# EAGLE design aasaver_v11 (EAGLE 5.11)
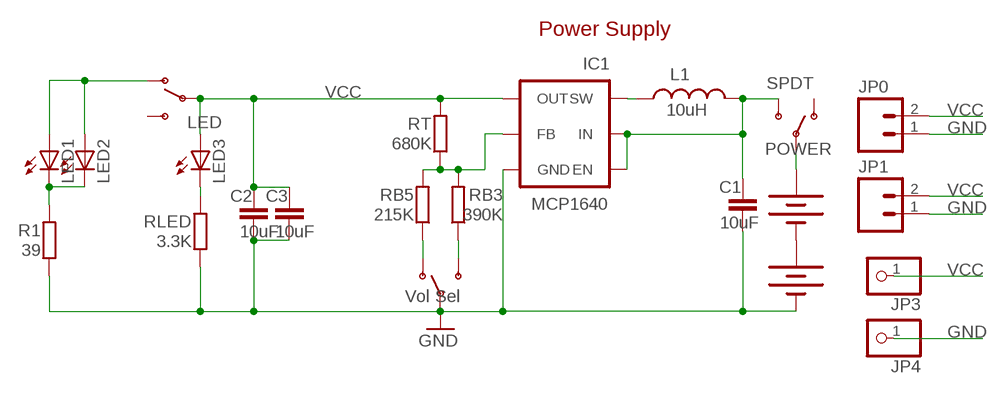
[diagram p0: schematic, sheet 1]

## Parts
AA1  BATTERYAA  [BATTERY-AA]
AA2  BATTERYAA  [BATTERY-AA]
C1  10uF  C-EUC0805  [C0805]
C2  10uF  C-EUC0805  [C0805]
C3  10uF  C-EUC0805  [C0805]
IC1  MCP1640  [TSOT23-6]
JP0  M021X02_NO_SILK  [1X02_NO_SILK]
JP1  M021X02_NO_SILK  [1X02_NO_SILK]
JP3  PINHD-1X1CB  [1X01-CLEANBIG]
JP4  PINHD-1X1CB  [1X01-CLEANBIG]
L1  10uH  INDUCTOR_SMDD30  [INDUCTOR_D30]
LED  SWITCH-SPSTSMD2  [SWITCH-SPDT-SMD]
LED1  LED3MM  [LED3MM]
LED2  LED3MM  [LED3MM]
LED3  0805  LEDCHIPLED_0805  [CHIPLED_0805]
POWER  SPDT  SWITCH-SPSTSMD2  [SWITCH-SPDT-SMD]
R1  39  R-EU_R0805  [R0805]
RB3  390K  R-EU_R0805  [R0805]
RB5  215K  R-EU_R0805  [R0805]
RLED  3.3K  R-EU_R0805  [R0805]
RT  680K  R-EU_R0805  [R0805]
VOL1  Vol Sel  SWITCH-SPSTSMD2  [SWITCH-SPDT-SMD]

## Nets
GND: AA2.GND@1(-) C1.2 C2.2 C3.2 IC1.2(GND) JP0.1 JP1.1 JP4.1 R1.1 RLED.1 VOL1.2(P)
N$1: IC1.4(FB) RB3.2 RB5.2 RT.1
N$2: RB5.1 VOL1.1(O)
N$3: RB3.1 VOL1.3(S)
N$4: LED1.K(C) LED2.K(C) R1.2
N$6: AA1.PWR@1(+) POWER.2(P)
N$7: LED1.A LED2.A LED.1(O)
N$8: LED3.C RLED.2
N$16: AA1.GND@1(-) AA2.PWR@1(+)
N$26 [power]: IC1.1(SW) L1.P$2
PWR [power]: C1.1 IC1.3(EN) IC1.6(IN) L1.P$1 POWER.3(S)
VCC: C2.1 C3.1 IC1.5(OUT) JP0.2 JP1.2 JP3.1 LED3.A LED.2(P) RT.2
Unconnected: LED.3(S) POWER.1(O)

## Notes on the sheet
- Power Supply

## Library data of the parts
AA1 AA2 = SparkFun:BATTERY: Battery Holders Various common sizes : AA, AAA, 20mm coin cell and 12mm coin cell.
C1-C3 = resistor:C-EU: CAPACITOR, European symbol
IC1 = linear-technology:MCP1640
JP0 JP1 = SparkFun:M02: Header 2 Standard 2-pin 0.1" header. Use with straight break away headers (SKU : PRT-00116), right angle break away headers (PRT-00553), swiss pins (PRT-00743), machine pins (PRT-00117), and female headers (PRT-00115). Molex polarized connector foot print use with SKU : PRT-08233 with associated crimp pins and housings.
JP3 JP4 = adafruit:PINHD-1X1: Pin header 1x1 for 0.1" spacing With round pins
L1 = linear-technology:INDUCTOR_SMD
LED POWER VOL1 = SparkFun:SWITCH-SPST: SPST Switch Simple slide switch. Spark Fun Electronics SKU : COM-00102
LED1 LED2 = adafruit:LED: LED
LED3 = led:LED: LED
R1 RB3 RB5 RLED RT = rcl:R-EU_: RESISTOR, European symbol

## Net classes
0 default: width 0.406 mm, clearance 0.203 mm
1 power: width 0.406 mm, clearance 0.203 mm

## Board
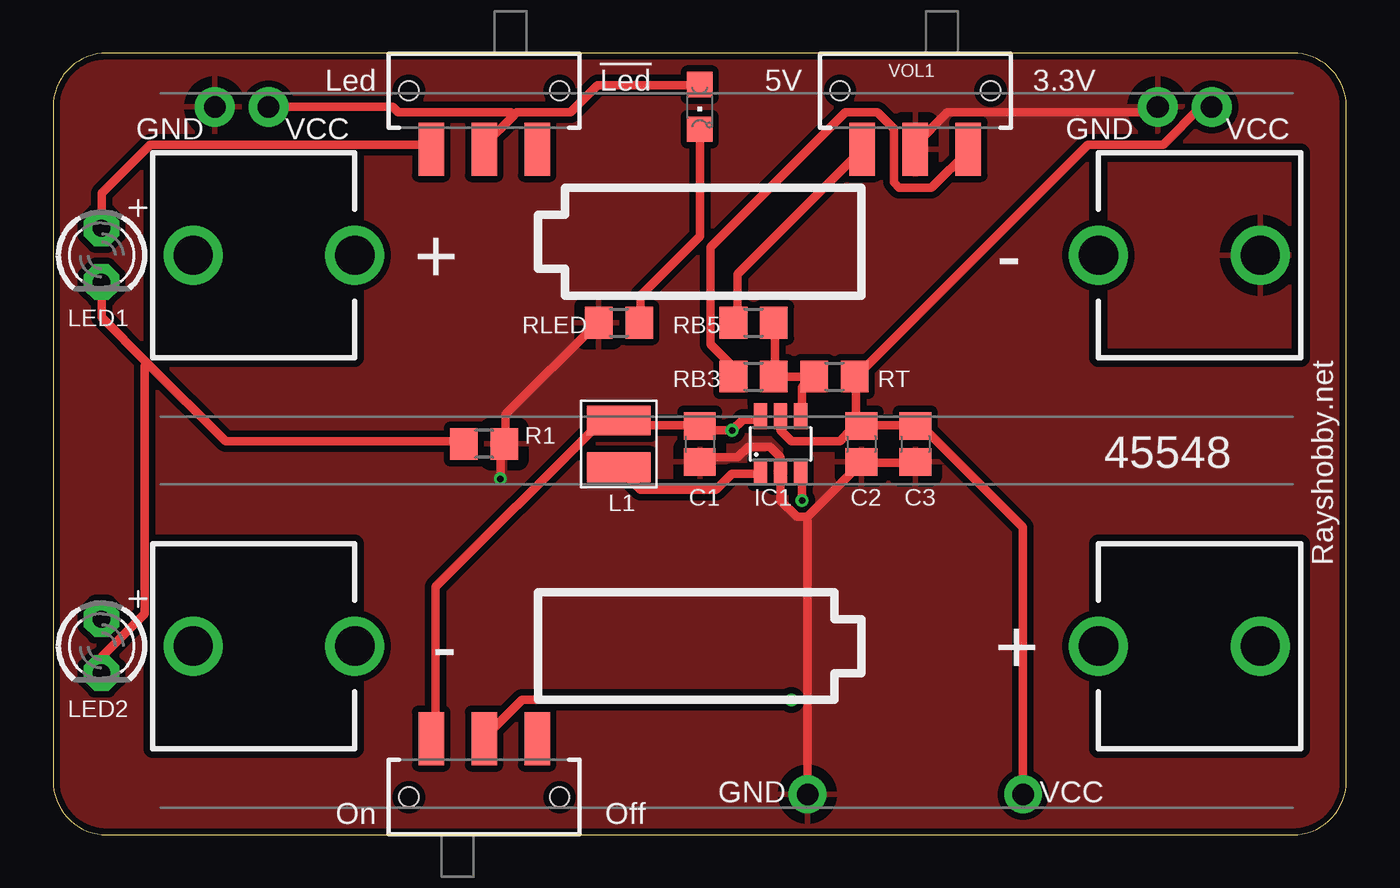
[diagram p1: board, top side]
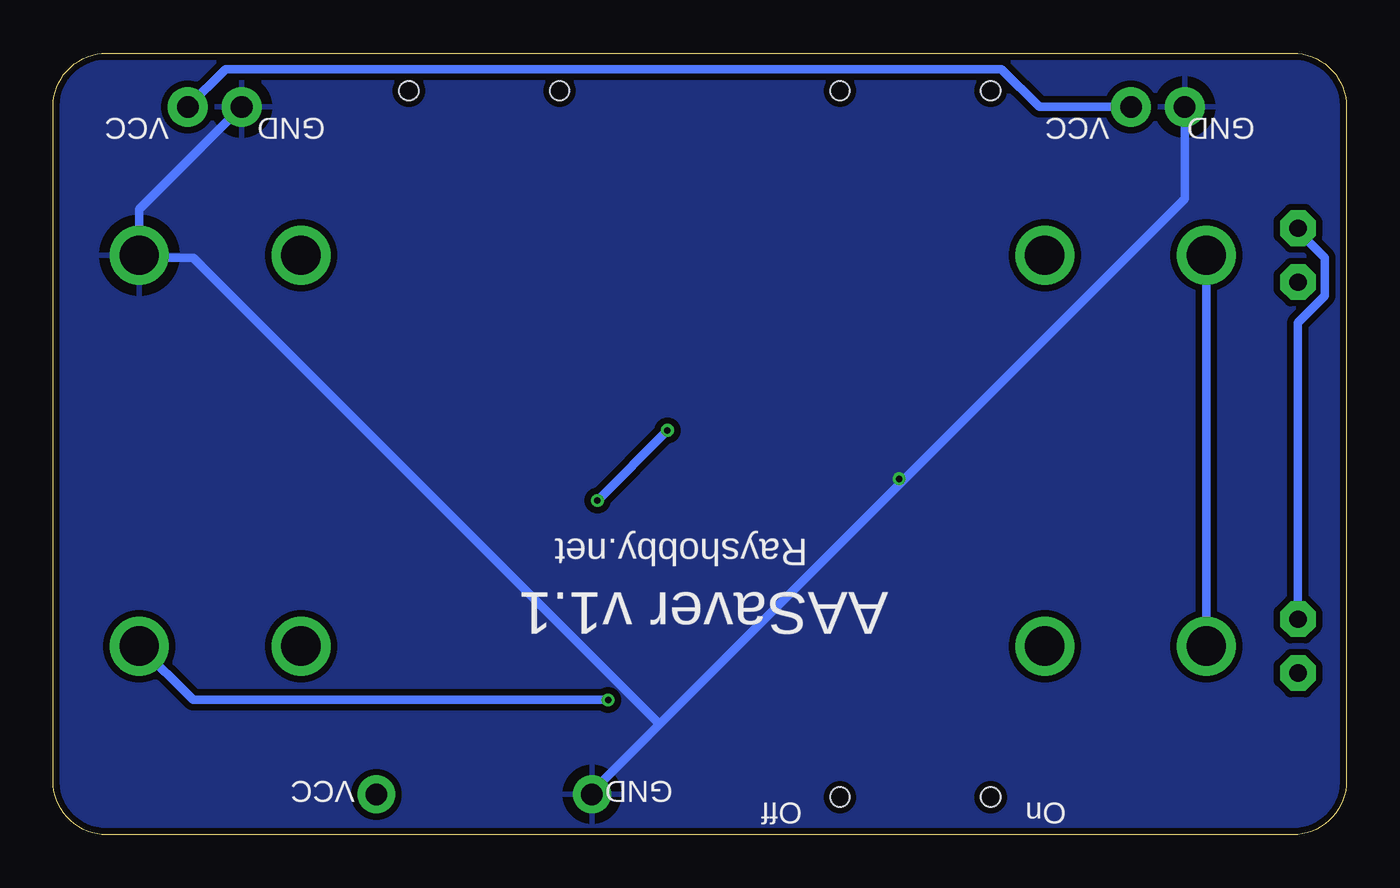
[diagram p2: board, bottom side, seen from below]

Size 60.96 x 36.83 mm. Coordinates in mm from the lower left corner, seen from the top.
Outline: 2.54,0 58.42,0 arc90 60.96,2.54 60.96,34.29 arc90 58.42,36.83 2.54,36.83 arc90 0,34.29 0,2.54 arc90 2.54,0
Copper layers (1*16): Top 0.035mm / dielectric 1.5mm / Bottom 0.035mm
Design rules "Fusion_eagle_rule_v1.1 *": minimum track width 6mil, minimum drill 12mil, track to track 6mil, track to pad 6mil, pad to pad 6mil, via to via 6mil, smd to smd 0mil, copper to edge 10mil, drill to drill 10mil, minimum pad ring 10mil, minimum via ring 6mil, stop-mask expansion 2mil, vias tented up to drill 100mil, thermal gap 20mil
vRestrict: area 32.5,17 to 36.1,19.8; area 21.6,8.9 to 43.2,14

### Footprints (pad centres in the part's own frame; a part is rotated, then mirrored left to right if it is on the bottom)
BATTERY-AA = drill 1.854 round: GND@1 25.146,0; GND@2 17.526,0; PWR@1 -25.146,0; PWR@2 -17.526,0
C0805 = smd 1.3 x 1.5: 1 -0.85,0; 2 0.85,0
TSOT23-6 = smd 0.62 x 1.22: 1 -0.95,-1.3; 2 0,-1.3; 3 0.95,-1.3; 4 0.95,1.3; 5 0,1.3; 6 -0.95,1.3
1X02_NO_SILK = drill 1.016 pad 1.88 round: 1 0,0; 2 2.54,0
1X01-CLEANBIG = drill 1.016 pad 1.778 round: 1 0,0
INDUCTOR_D30 = smd 1.4 x 3: P$1 -1.1,0; P$2 1.1,0
SWITCH-SPDT-SMD = smd 1.2 x 2.5: 1 -2.5,-2.75; 2 0,-2.75; 3 2.5,-2.75 | hole 0.9: -3.55,0; 3.55,0
LED3MM = drill 0.813 pad 1.676 octagon: A -1.27,0; K 1.27,0
CHIPLED_0805 = smd 1.2 x 1.2: A 0,-1.05; C 0,1.05
R0805 = smd 1.3 x 1.5: 1 -0.95,0; 2 0.95,0

### Placement (x,y rotation side)
AA1  31.75,8.89 180 top
AA2  31.75,27.3 0 top
C1  30.48,18.41 270 top
C2  38.1,18.41 270 top
C3  40.64,18.41 270 top
IC1  34.29,18.41 0 top
JP0  52.07,34.29 0 top
JP1  7.62,34.29 0 top
JP3  45.72,1.91 0 top
JP4  35.56,1.91 0 top
L1  26.67,18.41 270 top
LED  20.32,35.05 0 top
LED1  2.29,27.3 270 top
LED2  2.29,8.89 270 top
LED3  30.48,34.29 180 top
POWER  20.32,1.78 180 top
R1  20.32,18.41 180 top
RB3  33.02,21.59 0 top
RB5  33.02,24.13 0 top
RLED  26.67,24.13 0 top
RT  36.83,21.59 0 top
VOL1  40.64,35.05 0 top

### Tracks (layer width: path | path; a pad name or v marks a point on that pad's centre or on a via)
GND  (via drill 0.3)
  Top 0.406: JP0.1 51.82,34.04 42.16,34.04 40.64,32.51 VOL1.2 | RLED.1 25.65,24.13 21.34,19.81 21.34,18.54 R1.1 21.08,18.29 v21.08,16.76 | 35.56,14.99 35.05,14.99 34.29,15.75 IC1.2 34.29,17.78 33.78,18.29 32.77,18.29 32.26,17.78 30.48,17.78 C1.2 | 35.56,14.99 38.1,17.53 | 38.1,17.53 40.64,17.53 C3.2 | 38.1,17.53 C2.2 | JP4.1 35.56,14.99
  Bottom 0.406: JP0.1 56.9,29.46 AA2.GND@1 56.9,27.18 54.36,27.18 32.38,5.21 | JP1.1 7.62,29.97 20.95,16.64 | 32.38,5.21 35.56,2.03 JP4.1 | 32.38,5.21 20.95,16.64 | 20.95,16.64 v21.08,16.76
  pour Top (isolate 0.305): 0,36.83 60.96,36.83 60.96,0 0,0
  pour Bottom (isolate 0.305): 0,36.83 60.96,36.83 60.96,0 0,0
N$1
  Top 0.406: IC1.4 35.31,19.81 35.31,21.08 35.81,21.59 RT.1 34.04,21.59 | 34.04,21.59 34.04,24.13 RB5.2 | 34.04,21.59 RB3.2
N$2
  Top 0.406: RB5.1 32.26,24.13 32.26,26.42 38.1,32.26 VOL1.1
N$3
  Top 0.406: RB3.1 32,21.59 32,22.1 30.99,23.11 30.99,27.69 37.34,34.04 38.86,34.04 39.62,33.27 39.62,30.73 39.88,30.48 41.4,30.48 43.18,32.26 VOL1.3
N$4
  Top 0.406: 4.45,22.23 2.29,24.38 LED1.K | 4.45,22.23 8.13,18.54 19.3,18.54 R1.2 | LED2.K 2.29,8.38 4.32,10.41 4.32,22.1 4.45,22.23
N$6  (via drill 0.3)
  Top 0.406: v34.8,6.35 22.1,6.35 20.32,4.57 POWER.2
  Bottom 0.406: v34.8,6.35 54.36,6.35 AA1.PWR@1
N$7
  Top 0.406: LED.1 17.78,32.51 4.57,32.51 2.29,30.23 LED1.A
  Bottom 0.406: LED2.A 2.29,24.13 1.02,25.4 1.02,27.18 2.29,28.45 LED1.A
N$8
  Top 0.406: LED3.C 30.48,28.19 27.69,25.4 27.69,24.13 RLED.2
N$16
  Bottom 0.406: AA1.GND@1 AA2.PWR@1
N$26
  Top 0.406: IC1.1 33.27,17.02 32,17.02 31.24,16.26 27.69,16.26 26.67,17.27 L1.P$2
PWR  (via drill 0.3)
  Top 0.406: v35.31,15.75 35.31,17.02 IC1.3 | IC1.6 33.27,19.56 32.51,19.56 v32,19.05 30.48,19.05 C1.1 30.48,19.3 26.67,19.3 | 26.67,19.3 25.65,19.3 18.03,11.68 18.03,4.57 POWER.3 | 26.67,19.3 L1.P$1
  Bottom 0.406: v32,19.05 v35.31,15.75
VCC
  Top 0.406: 21.72,33.91 20.32,32.51 LED.2 | 21.72,33.91 21.84,34.04 24.38,34.04 25.65,35.31 30.48,35.31 LED3.A | JP1.2 16,34.29 16.26,34.04 21.59,34.04 21.72,33.91 | 37.85,19.05 38.1,19.05 C2.1 | 37.85,19.05 37.59,19.05 37.08,18.54 34.8,18.54 34.29,19.05 IC1.5 | 37.85,21.59 37.85,19.05 | 37.85,19.05 C2.1 | C2.1 38.1,19.3 40.64,19.3 C3.1 40.64,19.05 41.15,19.05 45.72,14.48 JP3.1 | JP0.2 54.1,34.29 52.32,32.51 48.77,32.51 37.85,21.59 | 37.85,21.59 RT.2
  Bottom 0.406: JP1.2 14.48,34.29 16.26,36.07 52.83,36.07 JP0.2

### Text on the board
tNames: Led | !Led | 5V | 3.3V | GND | VCC | GND | VCC | 45548 | Rayshobby.net | GND | VCC | On | Off
bNames: GND | VCC | GND | VCC | Rayshobby.net | AASaver v1.1 | GND | VCC | On | Off